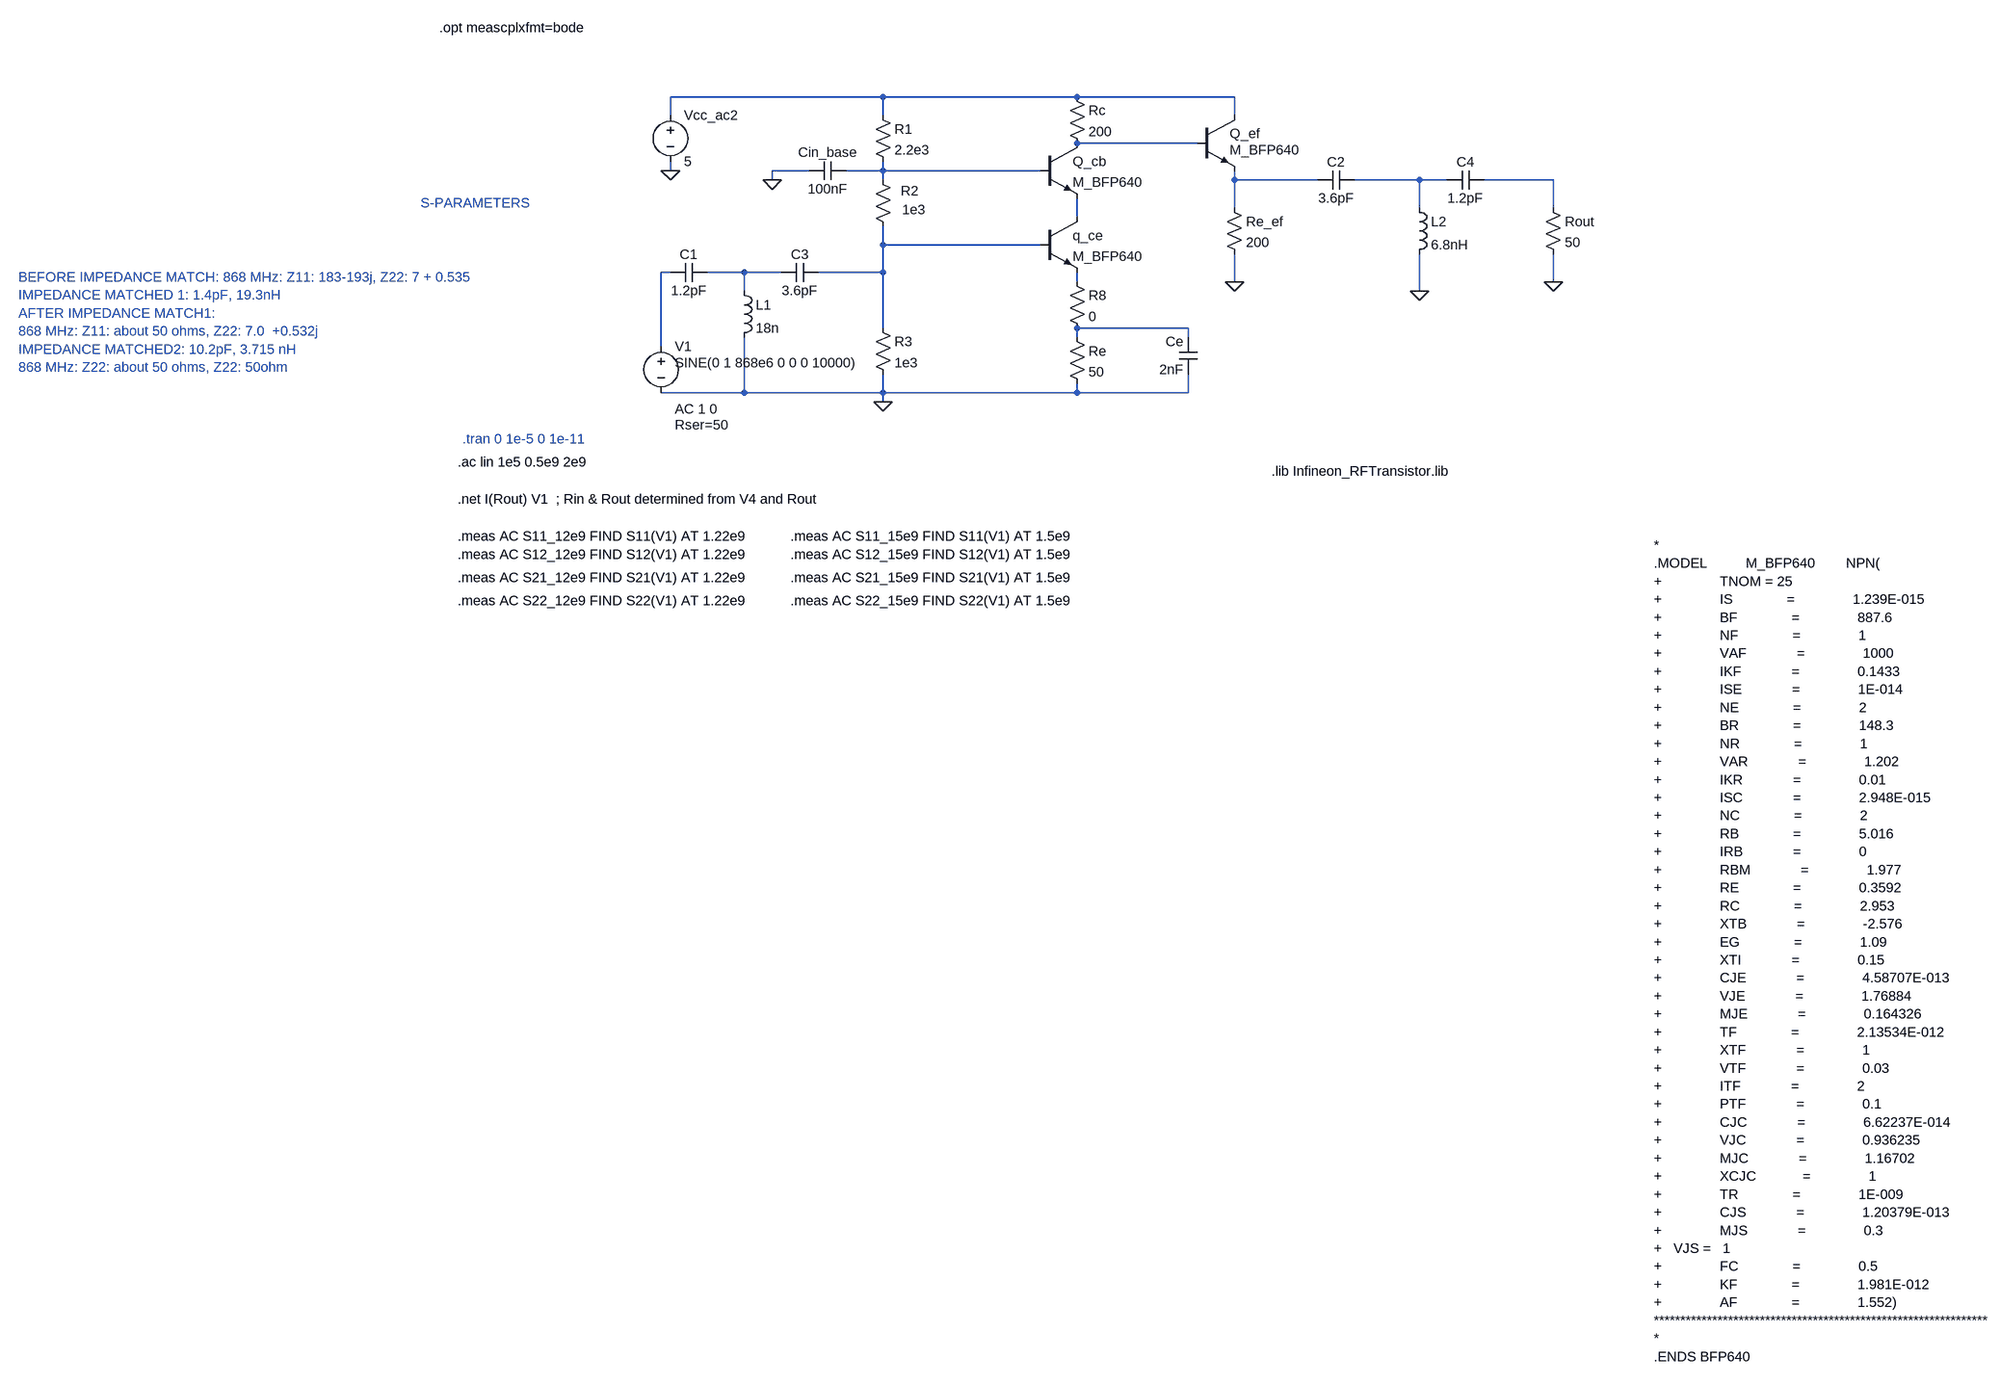
[diagram p0: schematic FDOM_LNA_IMPEDANCE_CALC.asc]
FDOM_LNA_IMPEDANCE_CALC.asc, the LTspice schematic file:
Version 4
SHEET 1 3348 3192
WIRE -80 592 -448 592
WIRE 256 592 -80 592
WIRE 528 592 256 592
WIRE -448 624 -448 592
WIRE -80 624 -80 592
WIRE 528 624 528 592
WIRE 464 672 256 672
WIRE -448 720 -448 704
WIRE -208 720 -272 720
WIRE -80 720 -80 704
WIRE -80 720 -144 720
WIRE 192 720 -80 720
WIRE -272 736 -272 720
WIRE -80 736 -80 720
WIRE 528 736 528 720
WIRE 672 736 528 736
WIRE 848 736 736 736
WIRE 896 736 848 736
WIRE 1088 736 960 736
WIRE 528 784 528 736
WIRE 848 784 848 736
WIRE 1088 784 1088 736
WIRE 256 800 256 768
WIRE -80 848 -80 816
WIRE 192 848 -80 848
WIRE -448 896 -464 896
WIRE -320 896 -384 896
WIRE -256 896 -320 896
WIRE -80 896 -80 848
WIRE -80 896 -192 896
WIRE 256 912 256 896
WIRE 528 912 528 864
WIRE 1088 912 1088 864
WIRE -320 928 -320 896
WIRE 848 928 848 864
WIRE -80 992 -80 896
WIRE 448 992 256 992
WIRE 256 1008 256 992
WIRE 448 1008 448 992
WIRE -464 1024 -464 896
WIRE -320 1104 -320 1008
WIRE -320 1104 -464 1104
WIRE -80 1104 -80 1072
WIRE -80 1104 -320 1104
WIRE 256 1104 256 1088
WIRE 256 1104 -80 1104
WIRE 448 1104 448 1072
WIRE 448 1104 256 1104
WIRE -80 1120 -80 1104
FLAG -448 720 0
FLAG -80 1120 0
FLAG -272 736 0
FLAG 528 912 0
FLAG 1088 912 0
FLAG 848 928 0
SYMBOL voltage -448 608 R0
WINDOW 123 0 0 Left 0
WINDOW 39 0 0 Left 0
SYMATTR InstName Vcc_ac2
SYMATTR Value 5
SYMBOL npn 192 800 R0
SYMATTR InstName q_ce
SYMATTR Value M_BFP640
SYMBOL res -96 608 R0
SYMATTR InstName R1
SYMATTR Value 2.2e3
SYMBOL res -96 976 R0
SYMATTR InstName R3
SYMATTR Value 1e3
SYMBOL res 240 992 R0
SYMATTR InstName Re
SYMATTR Value 50
SYMBOL res 240 576 R0
SYMATTR InstName Rc
SYMATTR Value 200
SYMBOL res -96 720 R0
WINDOW 0 47 35 Left 2
WINDOW 3 49 67 Left 2
SYMATTR InstName R2
SYMATTR Value 1e3
SYMBOL npn 192 672 R0
SYMATTR InstName Q_cb
SYMATTR Value M_BFP640
SYMBOL cap -144 704 R90
WINDOW 0 0 32 VBottom 2
WINDOW 3 32 32 VTop 2
SYMATTR InstName Cin_base
SYMATTR Value 100nF
SYMBOL cap 464 1072 R180
WINDOW 0 24 56 Left 2
WINDOW 3 24 8 Left 2
SYMATTR InstName Ce
SYMATTR Value 2nF
SYMBOL npn 464 624 R0
WINDOW 3 56 60 Left 2
SYMATTR Value M_BFP640
SYMATTR InstName Q_ef
SYMBOL res 512 768 R0
SYMATTR InstName Re_ef
SYMATTR Value 200
SYMBOL res 1072 768 R0
SYMATTR InstName Rout
SYMATTR Value 50
SYMBOL res 240 896 R0
SYMATTR InstName R8
SYMATTR Value 0
SYMBOL voltage -464 1008 R0
WINDOW 123 24 124 Left 2
WINDOW 39 24 152 Left 2
WINDOW 3 24 44 Left 2
SYMATTR Value2 AC 1 0
SYMATTR SpiceLine Rser=50
SYMATTR Value SINE(0 1 868e6 0 0 0 10000)
SYMATTR InstName V1
SYMBOL cap -384 880 R90
WINDOW 0 0 32 VBottom 2
WINDOW 3 32 32 VTop 2
SYMATTR InstName C1
SYMATTR Value 1.2pF
SYMBOL cap 736 720 R90
WINDOW 0 0 32 VBottom 2
WINDOW 3 32 32 VTop 2
SYMATTR InstName C2
SYMATTR Value 3.6pF
SYMBOL ind 832 768 R0
SYMATTR InstName L2
SYMATTR Value 6.8nH
SYMBOL ind -336 912 R0
SYMATTR InstName L1
SYMATTR Value 18n
SYMBOL cap -192 880 R90
WINDOW 0 0 32 VBottom 2
WINDOW 3 32 32 VTop 2
SYMATTR InstName C3
SYMATTR Value 3.6pF
SYMBOL cap 960 720 R90
WINDOW 0 0 32 VBottom 2
WINDOW 3 32 32 VTop 2
SYMATTR InstName C4
SYMATTR Value 1.2pF
TEXT -816 1224 Left 2 !.ac lin 1e5 0.5e9 2e9
TEXT -816 1288 Left 2 !.net I(Rout) V1  ; Rin & Rout determined from V4 and Rout
TEXT -880 776 Left 2 ;S-PARAMETERS
TEXT -816 1352 Left 2 !.meas AC S11_12e9 FIND S11(V1) AT 1.22e9
TEXT -848 472 Left 2 !.opt meascplxfmt=bode
TEXT -816 1384 Left 2 !.meas AC S12_12e9 FIND S12(V1) AT 1.22e9
TEXT -816 1424 Left 2 !.meas AC S21_12e9 FIND S21(V1) AT 1.22e9
TEXT -816 1464 Left 2 !.meas AC S22_12e9 FIND S22(V1) AT 1.22e9
TEXT -240 1352 Left 2 !.meas AC S11_15e9 FIND S11(V1) AT 1.5e9
TEXT -240 1384 Left 2 !.meas AC S12_15e9 FIND S12(V1) AT 1.5e9
TEXT -240 1424 Left 2 !.meas AC S21_15e9 FIND S21(V1) AT 1.5e9
TEXT -240 1464 Left 2 !.meas AC S22_15e9 FIND S22(V1) AT 1.5e9
TEXT 592 1240 Left 2 !.lib Infineon_RFTransistor.lib
TEXT 2424 1368 Left 2 !*\n.MODEL          M_BFP640        NPN(\n+               TNOM = 25\n+               IS              =               1.239E-015\n+               BF              =               887.6\n+               NF              =               1\n+               VAF             =               1000\n+               IKF             =               0.1433\n+               ISE             =               1E-014\n+               NE              =               2\n+               BR              =               148.3\n+               NR              =               1\n+               VAR             =               1.202\n+               IKR             =               0.01\n+               ISC             =               2.948E-015\n+               NC              =               2\n+               RB              =               5.016\n+               IRB             =               0\n+               RBM             =               1.977\n+               RE              =               0.3592\n+               RC              =               2.953\n+               XTB             =               -2.576\n+               EG              =               1.09\n+               XTI             =               0.15\n+               CJE             =               4.58707E-013\n+               VJE             =               1.76884\n+               MJE             =               0.164326\n+               TF              =               2.13534E-012\n+               XTF             =               1\n+               VTF             =               0.03\n+               ITF             =               2\n+               PTF             =               0.1\n+               CJC             =               6.62237E-014\n+               VJC             =               0.936235\n+               MJC             =               1.16702\n+               XCJC            =               1\n+               TR              =               1E-009\n+               CJS             =               1.20379E-013\n+               MJS             =               0.3\n+   VJS =   1\n+               FC              =               0.5\n+               KF              =               1.981E-012\n+               AF              =               1.552)\n***************************************************************\n*\n.ENDS BFP640
TEXT -1576 904 Left 2 ;BEFORE IMPEDANCE MATCH: 868 MHz: Z11: 183-193j, Z22: 7 + 0.535\nIMPEDANCE MATCHED 1: 1.4pF, 19.3nH\nAFTER IMPEDANCE MATCH1: \n868 MHz: Z11: about 50 ohms, Z22: 7.0  +0.532j\nIMPEDANCE MATCHED2: 10.2pF, 3.715 nH\n868 MHz: Z22: about 50 ohms, Z22: 50ohm
TEXT -808 1184 Left 2 ;.tran 0 1e-5 0 1e-11

The netlist it stands for:
* FDOM_LNA_IMPEDANCE_CALC.asc
Vcc_ac2 N001 0 5
q_ce N007 N008 N011 0 M_BFP640
R1 N001 N003 2.2e3
R3 N008 0 1e3
Re N012 0 50
Rc N001 N002 200
R2 N003 N008 1e3
Q_cb N002 N003 N007 0 M_BFP640
Cin_base N003 0 100nF
Ce 0 N012 2nF
Q_ef N001 N002 N004 0 M_BFP640
Re_ef N004 0 200
Rout N006 0 50
R8 N011 N012 0
V1 N009 0 SINE(0 1 868e6 0 0 0 10000) AC 1 0 Rser=50
C1 N010 N009 1.2pF
C2 N005 N004 3.6pF
L2 N005 0 6.8nH
L1 N010 0 18n
C3 N008 N010 3.6pF
C4 N006 N005 1.2pF
.model NPN NPN
.model PNP PNP
.lib standard.bjt
.ac lin 1e5 0.5e9 2e9
.net I(Rout) V1  ; Rin & Rout determined from V4 and Rout
* S-PARAMETERS
.meas AC S11_12e9 FIND S11(V1) AT 1.22e9
.opt meascplxfmt=bode
.meas AC S12_12e9 FIND S12(V1) AT 1.22e9
.meas AC S21_12e9 FIND S21(V1) AT 1.22e9
.meas AC S22_12e9 FIND S22(V1) AT 1.22e9
.meas AC S11_15e9 FIND S11(V1) AT 1.5e9
.meas AC S12_15e9 FIND S12(V1) AT 1.5e9
.meas AC S21_15e9 FIND S21(V1) AT 1.5e9
.meas AC S22_15e9 FIND S22(V1) AT 1.5e9
.lib Infineon_RFTransistor.lib
*
.MODEL          M_BFP640        NPN(
+               TNOM = 25
+               IS              =               1.239E-015
+               BF              =               887.6
+               NF              =               1
+               VAF             =               1000
+               IKF             =               0.1433
+               ISE             =               1E-014
+               NE              =               2
+               BR              =               148.3
+               NR              =               1
+               VAR             =               1.202
+               IKR             =               0.01
+               ISC             =               2.948E-015
+               NC              =               2
+               RB              =               5.016
+               IRB             =               0
+               RBM             =               1.977
+               RE              =               0.3592
+               RC              =               2.953
+               XTB             =               -2.576
+               EG              =               1.09
+               XTI             =               0.15
+               CJE             =               4.58707E-013
+               VJE             =               1.76884
+               MJE             =               0.164326
+               TF              =               2.13534E-012
+               XTF             =               1
+               VTF             =               0.03
+               ITF             =               2
+               PTF             =               0.1
+               CJC             =               6.62237E-014
+               VJC             =               0.936235
+               MJC             =               1.16702
+               XCJC            =               1
+               TR              =               1E-009
+               CJS             =               1.20379E-013
+               MJS             =               0.3
+   VJS =   1
+               FC              =               0.5
+               KF              =               1.981E-012
+               AF              =               1.552)
***************************************************************
*
.ENDS BFP640
* BEFORE IMPEDANCE MATCH: 868 MHz: Z11: 183-193j, Z22: 7 + 0.535
* IMPEDANCE MATCHED 1: 1.4pF, 19.3nH
* AFTER IMPEDANCE MATCH1:
* 868 MHz: Z11: about 50 ohms, Z22: 7.0  +0.532j
* IMPEDANCE MATCHED2: 10.2pF, 3.715 nH
* 868 MHz: Z22: about 50 ohms, Z22: 50ohm
* .tran 0 1e-5 0 1e-11
.backanno
.end